# Altium schematic sheet Uav_V2.SchDoc: UAV Serial Switch
size A3; DrawnBy: Stefanie Schmidiger; Organization: HSLU T&A; Address1: Abteilung Elektrotechnik; Address2: Technikumsstrasse 21; Address3: CH-6048 Horw; Revision: 1; SheetNumber: 1; SheetTotal: 1; Projektname: UAV Serial Switch; PageSetup: Record=PageOptions|CenterHorizontal=True|CenterVertical=True|PrintScale=0.73|XCorrection=1.00|YCorrection=1.00|PrintKind=0|BorderSize=5000000|LeftOffset=0|BottomOffset=0|Orientation=2|PaperLength=1000|PaperWidth=1000|Scale=100|PaperSource=7|PrintQuality=-3|MediaType=1|DitherType=10|PrintScaleMode=1|PaperKind=A4|PaperIndex=9
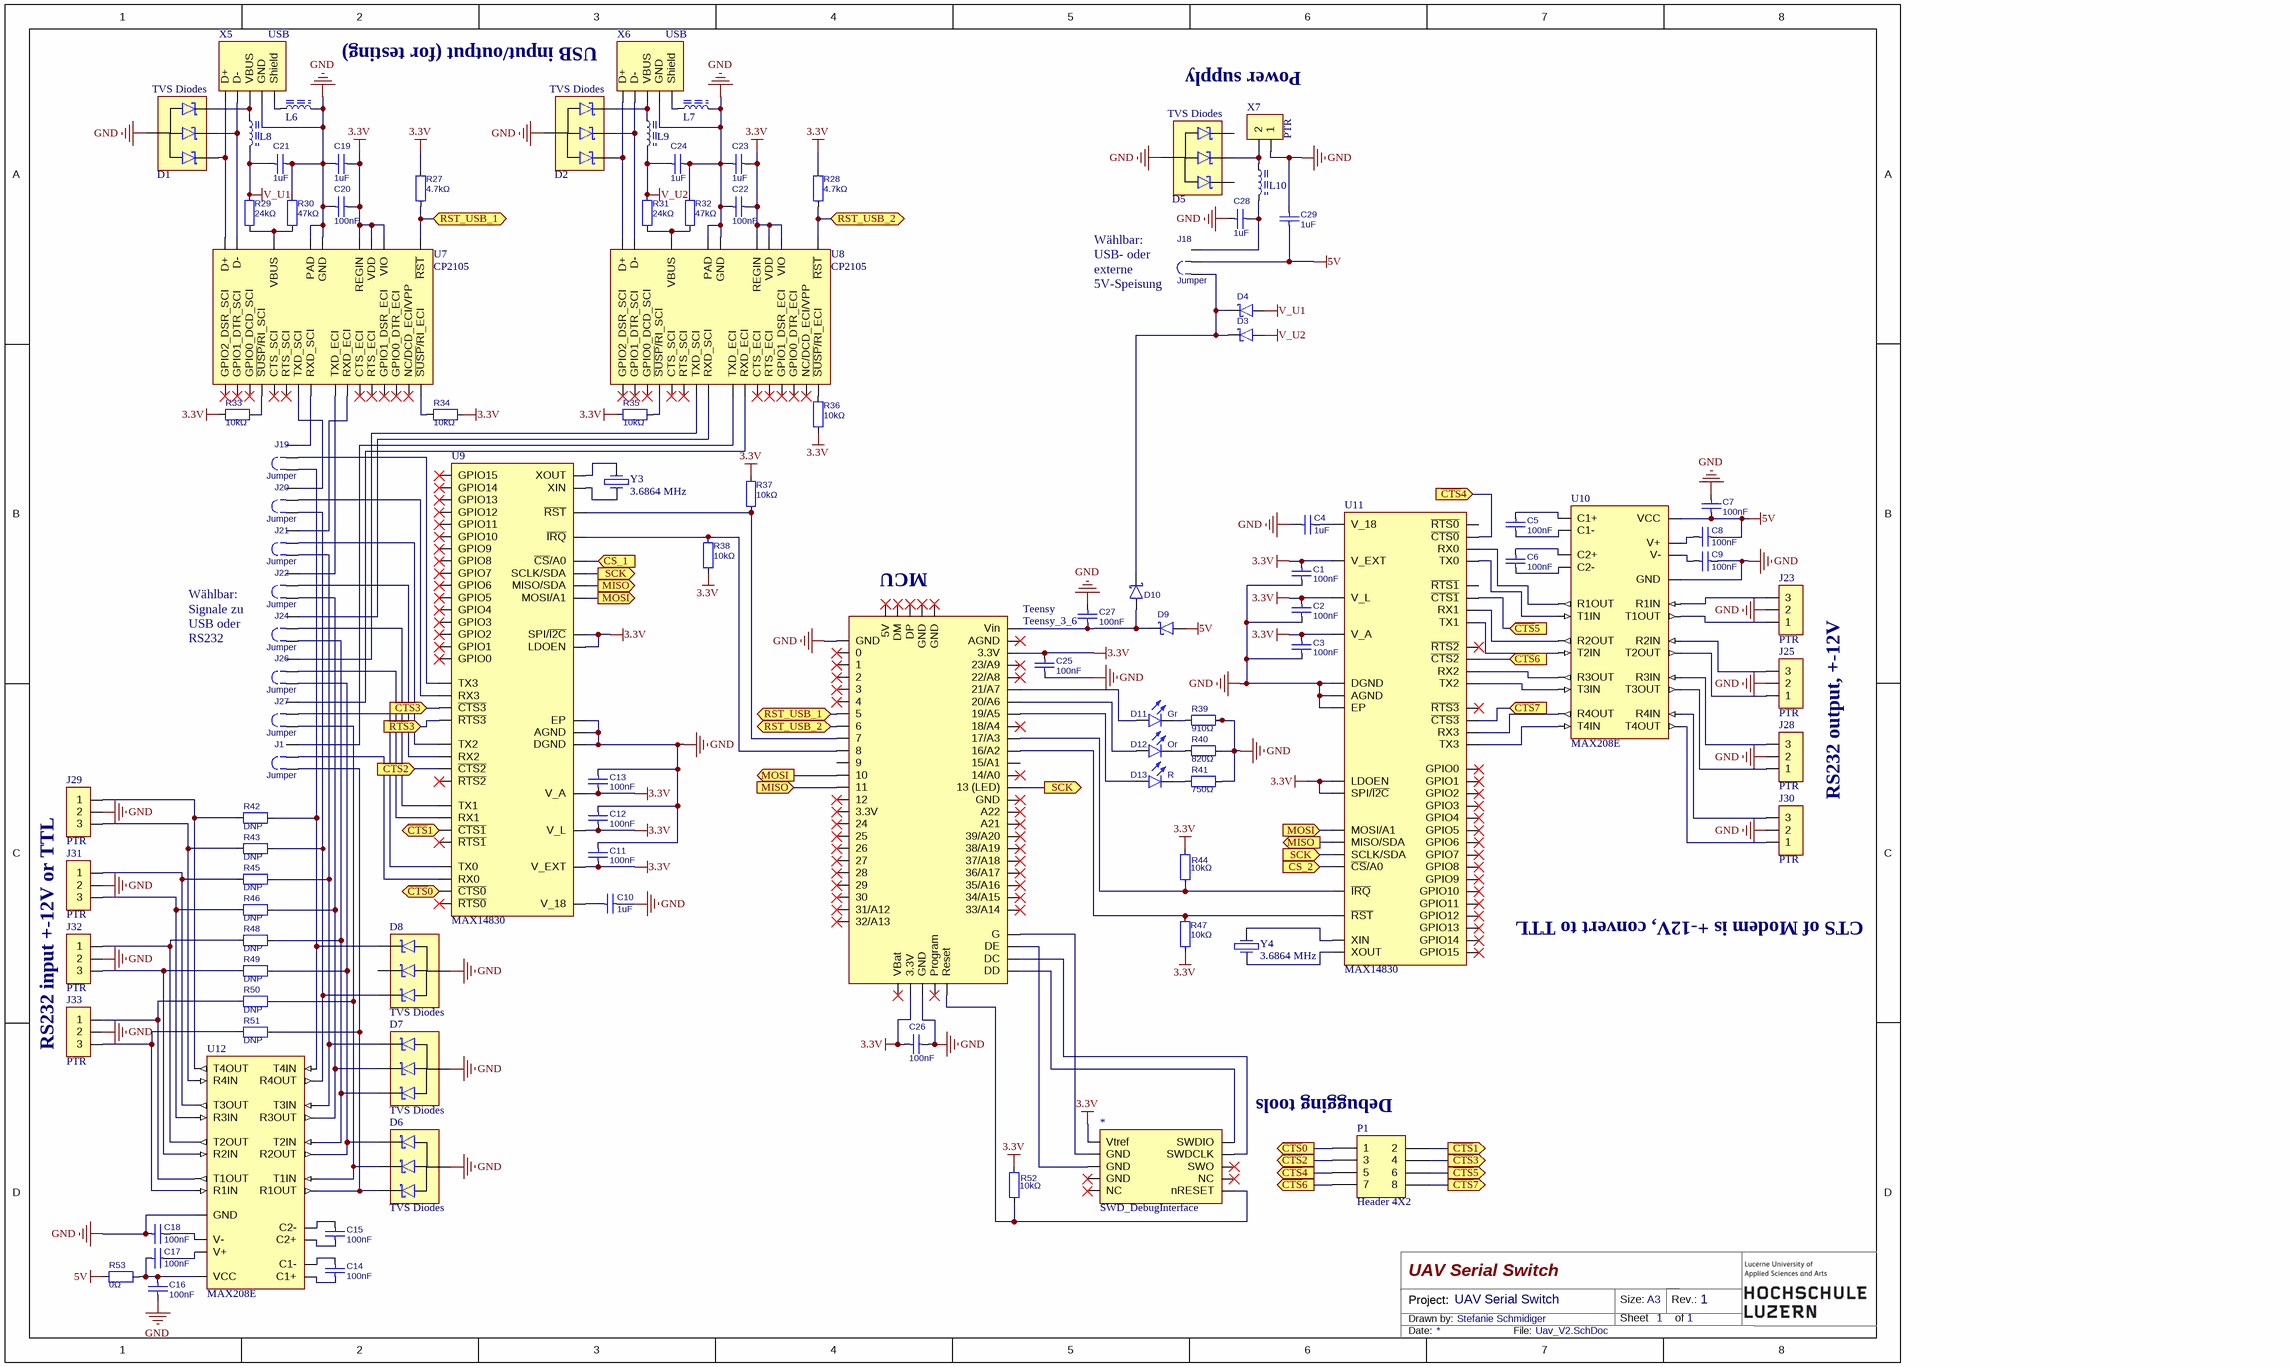
[diagram p0: Uav_V2.SchDoc]

## Parts
*  SWD_DebugInterface  [SWD Debug Interface]
C1  100nF  [0603]
C2  100nF  [0603]
C3  100nF  [0603]
C4  1uF  [0603]
C5  100nF  [0603]
C6  100nF  [0603]
C7  100nF  [0603]
C8  100nF  [0603]
C9  100nF  [0603]
C10  1uF  [0603]
C11  100nF  [0603]
C12  100nF  [0603]
C13  100nF  [0603]
C14  100nF  [0603]
C15  100nF  [0603]
C16  100nF  [0603]
C17  100nF  [0603]
C18  100nF  [0603]
C19  1uF  [0603]
C20  100nF  [0603]
C21  1uF  [0603]
C22  100nF  [0603]
C23  1uF  [0603]
C24  1uF  [0603]
C25  100nF  [0603]
C26  100nF  [0603]
C27  100nF  [0603]
C28  1uF  [0603]
C29  1uF  [0603]
D1  TVS Diodes  [SOT-143-4]
D2  TVS Diodes  [SOT-143-4]
D3  ?  [SOD_123]  (value not drawn)
D4  ?  [SOD_123]  (value not drawn)
D5  TVS Diodes  [SOT-143-4]
D6  TVS Diodes  [SOT-143-4]
D7  TVS Diodes  [SOT-143-4]
D8  TVS Diodes  [SOT-143-4]
D9  ?  [SOD_123]  (value not drawn)
D10  ?  [SOD_123]  (value not drawn)
D11  Gr  [0603D]
D12  Or  [0603D]
D13  R  [0603D]
J1  Jumper  [HDR1X3]
J18  Jumper  [HDR1X3]
J19  Jumper  [HDR1X3]
J20  Jumper  [HDR1X3]
J21  Jumper  [HDR1X3]
J22  Jumper  [HDR1X3]
J23  PTR  [PTR_1X3]
J24  Jumper  [HDR1X3]
J25  PTR  [PTR_1X3]
J26  Jumper  [HDR1X3]
J27  Jumper  [HDR1X3]
J28  PTR  [PTR_1X3]
J29  PTR  [PTR_1X3]
J30  PTR  [PTR_1X3]
J31  PTR  [PTR_1X3]
J32  PTR  [PTR_1X3]
J33  PTR  [PTR_1X3]
L6  MPZ1608S601A  [0603]  (value not drawn)
L7  MPZ1608S601A  [0603]  (value not drawn)
L8  MPZ1608S601A  [0603]  (value not drawn)
L9  MPZ1608S601A  [0603]  (value not drawn)
L10  MPZ1608S601A  [0603]  (value not drawn)
P1  Header 4X2  [HDR2X4]
R27  4.7kΩ  [0603]
R28  4.7kΩ  [0603]
R29  24kΩ  [0603]
R30  47kΩ  [0603]
R31  24kΩ  [0603]
R32  47kΩ  [0603]
R33  10kΩ  [0603]
R34  10kΩ  [0603]
R35  10kΩ  [0603]
R36  10kΩ  [0603]
R37  10kΩ  [0603]
R38  10kΩ  [0603]
R39  910Ω  [0603]
R40  820Ω  [0603]
R41  750Ω  [0603]
R42  DNP  [0603]
R43  DNP  [0603]
R44  10kΩ  [0603]
R45  DNP  [0603]
R46  DNP  [0603]
R47  10kΩ  [0603]
R48  DNP  [0603]
R49  DNP  [0603]
R50  DNP  [0603]
R51  DNP  [0603]
R52  10kΩ  [0603]
R53  0Ω  [0603]
Teensy  Teensy_3_6
U7  CP2105  [QFN24]
U8  CP2105  [QFN24]
U9  MAX14830  [TQFN48]
U10  MAX208E  [SSOP24]
U11  MAX14830  [TQFN48]
U12  MAX208E  [SSOP24]
X5  USB  [ZX63-B-5PA(30)]
X6  USB  [ZX63-B-5PA(30)]
X7  PTR  [PTR_1X2]
Y3  3.6864 MHz  [Crystal_10x4_5mm]
Y4  3.6864 MHz  [Crystal_10x4_5mm]

## Ports
CS_1 (in), CS_2 (in), MISO (in), MISO (out), MOSI (in), MOSI (out), RST_USB_1, RST_USB_2, SCK (in), SCK (out), ~{CTS}0 (in), ~{CTS}0 (out), ~{CTS}1 (in), ~{CTS}1 (out), ~{CTS}2 (in), ~{CTS}2 (out), ~{CTS}3 (in), ~{CTS}3 (out), ~{CTS}4 (in), ~{CTS}4 (out), ~{CTS}5 (in), ~{CTS}5 (out), ~{CTS}6 (in), ~{CTS}6 (out), ~{CTS}7 (in), ~{CTS}7 (out), ~{RTS}3 (in)

## Nets
3.3V: *.1(Vtref) C1.2 C2.2 C3.2 C11.2 C12.2 C13.2 C19.1 C20.1 C22.1 C23.1 C25.1 C26.1 R27.2 R28.2 R33.2 R34.1 R35.2 R36.1 R37.2 R38.1 R44.2 R47.1 R52.2 Teensy.3.3V_1(3.3V) Teensy.3.3V_2(3.3V) U7.5(VIO) U7.6(VDD) U7.7(REGIN) U8.5(VIO) U8.6(VDD) U8.7(REGIN) U9.1(SPI/~{I2C}) U9.2(LDOEN) U9.9(V_L) U9.43(V_EXT) U9.47(V_A) U11.1(SPI/~{I2C}) U11.2(LDOEN) U11.9(V_L) U11.43(V_EXT) U11.47(V_A)
5V: C7.1 C8.1 C29.1 D9.1(A) J18.2 R53.2 U10.9(VCC)
GND: C1.1 C2.1 C3.1 C4.1 C7.2 C9.1 C10.1 C11.1 C12.1 C13.1 C16.2 C18.1 C19.2 C20.2 C21.1 C22.2 C23.2 C24.1 C25.2 C26.2 C27.1 C28.2 C29.2 D1.1(CA) D2.1(CA) D5.1(CA) D6.1(CA) D7.1(CA) D8.1(CA) J23.2 J25.2 J28.2 J29.2 J30.2 J31.2 J32.2 J33.2 L6.2 L7.2 R30.1 R32.1 R39.1 R40.1 R41.1 Teensy.GND_1(GND) Teensy.GND_2(GND) U7.2(GND) U7.25(PAD) U8.2(GND) U8.25(PAD) U9.10(DGND) U9.46(AGND) U9.49(EP) U10.8(GND) U11.10(DGND) U11.46(AGND) U11.49(EP) U12.8(GND) X5.4(GND) X6.4(GND) X7.1
V_U1: C21.2 D4.1(A) L8.2 R29.1
V_U2: C24.2 D3.1(A) L9.2 R31.1
~{CTS}0: P1.1 U9.16(~{CTS0}) ; port ~{CTS}0
~{CTS}1: P1.2 U9.24(~{CTS1}) ; port ~{CTS}1
~{CTS}2: P1.3 U9.32(~{CTS2}) ; port ~{CTS}2
~{CTS}3: P1.4 U9.40(~{CTS3}) ; port ~{CTS}3
~{CTS}4: P1.5 U11.16(~{CTS0}) ; port ~{CTS}4
~{CTS}5: P1.6 U11.24(~{CTS1}) ; port ~{CTS}5
~{CTS}6: P1.7 U11.32(~{CTS2}) ; port ~{CTS}6
~{CTS}7: P1.8 U11.40(~{CTS3}) ; port ~{CTS}7
~{RTS}3: U9.39(~{RTS3}) ; port ~{RTS}3
CS_1: U9.5(~{CS}/A0) ; port CS_1
CS_2: U11.5(~{CS}/A0) ; port CS_2
MISO: Teensy.11 U9.3(MISO/SDA) U11.3(MISO/SDA) ; port MISO
MOSI: Teensy.10 U9.6(MOSI/A1) U11.6(MOSI/A1) ; port MOSI
RST_USB_1: R27.1 Teensy.5 U7.9(~{RST}) ; port RST_USB_1
RST_USB_2: R28.1 Teensy.6 U8.9(~{RST}) ; port RST_USB_2
SCK: Teensy.13(13_(LED)) U9.4(SCLK/SDA) U11.4(SCLK/SDA) ; port SCK
Net*_2: *.2(SWDIO) Teensy.DD
Net*_4: *.4(SWDCLK) Teensy.DC
Net*_7: *.7(GND) Teensy.DE
Net*_9: *.9(GND) Teensy.GND_4(G)
Net*_10: *.10(nRESET) R52.1 Teensy.Reset
NetC4_2: C4.2 U11.48(V_18)
NetC5_1: C5.1 U10.12(C1-)
NetC5_2: C5.2 U10.10(C1+)
NetC6_1: C6.1 U10.14(C2-)
NetC6_2: C6.2 U10.13(C2+)
NetC8_2: C8.2 U10.11(V+)
NetC9_2: C9.2 U10.15(V-)
NetC10_2: C10.2 U9.48(V_18)
NetC14_1: C14.1 U12.12(C1-)
NetC14_2: C14.2 U12.10(C1+)
NetC15_1: C15.1 U12.14(C2-)
NetC15_2: C15.2 U12.13(C2+)
NetC16_1: C16.1 C17.1 R53.1 U12.9(VCC)
NetC17_2: C17.2 U12.11(V+)
NetC18_2: C18.2 U12.15(V-)
NetC27_2: C27.2 D9.2(K) D10.1(A) Teensy.Vin
NetC28_1: C28.1 J18.3 L10.2
NetD1_2: D1.2(K1) U7.3(D+) X5.3(D+)
NetD1_3: D1.3(K2) U7.4(D-) X5.2(D-)
NetD1_4: D1.4(K3) L8.1 X5.1(VBUS)
NetD2_2: D2.2(K1) U8.3(D+) X6.3(D+)
NetD2_3: D2.3(K2) U8.4(D-) X6.2(D-)
NetD2_4: D2.4(K3) L9.1 X6.1(VBUS)
NetD3_2: D3.2(K) D4.2(K) D10.2(K) J18.1
NetD5_3: D5.3(K2) L10.1 X7.2
NetD6_2: D6.2(K1) J26.1 R49.1 U12.4(R2OUT)
NetD6_3: D6.3(K2) J27.1 R50.1 U12.5(T1IN)
NetD6_4: D6.4(K3) J1.1 R51.1 U12.6(R1OUT)
NetD7_2: D7.2(K1) J21.1 R45.1 U12.19(T3IN)
NetD7_3: D7.3(K2) J22.1 R46.1 U12.22(R3OUT)
NetD7_4: D7.4(K3) J24.1 R48.1 U12.18(T2IN)
NetD8_2: D8.2(K1) J19.1 R42.1 U12.21(T4IN)
NetD8_4: D8.4(K3) J20.1 R43.1 U12.17(R4OUT)
NetD11_1: D11.1(A) Teensy.21(21/A7)
NetD11_2: D11.2(K) R39.2
NetD12_1: D12.1(A) Teensy.20(20/A6)
NetD12_2: D12.2(K) R40.2
NetD13_1: D13.1(A) Teensy.19(19/A5)
NetD13_2: D13.2(K) R41.2
NetJ1_2: J1.2 U9.17(RX0)
NetJ1_3: J1.3 U8.13(TXD_ECI)
NetJ19_2: J19.2 U9.42(TX3)
NetJ19_3: J19.3 U7.20(RXD_SCI)
NetJ20_2: J20.2 U9.41(RX3)
NetJ20_3: J20.3 U7.21(TXD_SCI)
NetJ21_2: J21.2 U9.34(TX2)
NetJ21_3: J21.3 U7.12(RXD_ECI)
NetJ22_2: J22.2 U9.33(RX2)
NetJ22_3: J22.3 U7.13(TXD_ECI)
NetJ23_1: J23.1 U10.2(T1OUT)
NetJ23_3: J23.3 U10.7(R1IN)
NetJ24_2: J24.2 U9.26(TX1)
NetJ24_3: J24.3 U8.20(RXD_SCI)
NetJ25_1: J25.1 U10.1(T2OUT)
NetJ25_3: J25.3 U10.3(R2IN)
NetJ26_2: J26.2 U9.25(RX1)
NetJ26_3: J26.3 U8.21(TXD_SCI)
NetJ27_2: J27.2 U9.18(TX0)
NetJ27_3: J27.3 U8.12(RXD_ECI)
NetJ28_1: J28.1 U10.24(T3OUT)
NetJ28_3: J28.3 U10.23(R3IN)
NetJ29_1: J29.1 R42.2 U12.20(T4OUT)
NetJ29_3: J29.3 R43.2 U12.16(R4IN)
NetJ30_1: J30.1 U10.20(T4OUT)
NetJ30_3: J30.3 U10.16(R4IN)
NetJ31_1: J31.1 R45.2 U12.24(T3OUT)
NetJ31_3: J31.3 R46.2 U12.23(R3IN)
NetJ32_1: J32.1 R48.2 U12.1(T2OUT)
NetJ32_3: J32.3 R49.2 U12.3(R2IN)
NetJ33_1: J33.1 R50.2 U12.2(T1OUT)
NetJ33_3: J33.3 R51.2 U12.7(R1IN)
NetL6_1: L6.1 X5.0(Shield)
NetL7_1: L7.1 X6.0(Shield)
NetR29_2: R29.2 R30.2 U7.8(VBUS)
NetR31_2: R31.2 R32.2 U8.8(VBUS)
NetR33_1: R33.1 U7.1(~{SUSP}/RI_SCI)
NetR34_2: R34.2 U7.17(~{SUSP}/RI_ECI)
NetR35_1: R35.1 U8.1(~{SUSP}/RI_SCI)
NetR36_2: R36.2 U8.17(~{SUSP}/RI_ECI)
NetR37_1: R37.1 Teensy.7 U9.8(~{RST})
NetR38_2: R38.2 Teensy.8 U9.7(~{IRQ})
NetR44_1: R44.1 Teensy.17(17/A3) U11.7(~{IRQ})
NetR47_2: R47.2 Teensy.16(16/A2) U11.8(~{RST})
NetU9_44: U9.44(XOUT) Y3.2
NetU9_45: U9.45(XIN) Y3.1
NetU10_4: U10.4(R2OUT) U11.25(RX1)
NetU10_5: U10.5(T1IN) U11.18(TX0)
NetU10_6: U10.6(R1OUT) U11.17(RX0)
NetU10_17: U10.17(R4OUT) U11.41(RX3)
NetU10_18: U10.18(T2IN) U11.26(TX1)
NetU10_19: U10.19(T3IN) U11.34(TX2)
NetU10_21: U10.21(T4IN) U11.42(TX3)
NetU10_22: U10.22(R3OUT) U11.33(RX2)
NetU11_44: U11.44(XOUT) Y4.1
NetU11_45: U11.45(XIN) Y4.2

Not connected (* = marked no-connect by the designer): * 3(NC)* 5(GND)* 6(SWO)* 8(NC)*; D5 2(K1) 4(K3); D8 3(K2); Teensy 0* 1* 2* 3* 3.3V* 4* 5V_USB(5V)* 9 12* 14(14/A0)* 15(15/A1) 18(18/A4)* 22(22/A8)* 23(23/A9)* 24* 25* 26* 27* 28* 29* 30* 31(31/A12)* 32(32/A13)* 33(33/A14)* 34(34/A15)* 35(35/A16)* 36(36/A17)* 37(37/A18)* 38(38/A19)* 39(39/A20)* A21* A22* AGND* DM* DP* GND_3(GND)* GND_5(GND)* GND_6(GND)* Program* VBat*; U7 10(CTS_ECI)* 11(RTS_ECI)* 14(GPIO1_DSR_ECI)* 15(GPIO0_DTR_ECI)* 16(NC/DCD_ECI/VPP)* 18(CTS_SCI)* 19(RTS_SCI)* 22(GPIO2_DSR_SCI)* 23(GPIO1_DTR_SCI)* 24(GPIO0_DCD_SCI)*; U8 10(CTS_ECI)* 11(RTS_ECI)* 14(GPIO1_DSR_ECI)* 15(GPIO0_DTR_ECI)* 16(NC/DCD_ECI/VPP)* 18(CTS_SCI)* 19(RTS_SCI)* 22(GPIO2_DSR_SCI)* 23(GPIO1_DTR_SCI)* 24(GPIO0_DCD_SCI)*; U9 11(GPIO0)* 12(GPIO1)* 13(GPIO2)* 14(GPIO3)* 15(~{RTS0})* 19(GPIO4)* 20(GPIO5)* 21(GPIO6)* 22(GPIO7)* 23(~{RTS1})* 27(GPIO8)* 28(GPIO9)* 29(GPIO10)* 30(GPIO11)* 31(~{RTS2})* 35(GPIO12)* 36(GPIO13)* 37(GPIO14)* 38(GPIO15)*; U11 11(GPIO0)* 12(GPIO1)* 13(GPIO2)* 14(GPIO3)* 15(~{RTS0}) 19(GPIO4)* 20(GPIO5)* 21(GPIO6)* 22(GPIO7)* 23(~{RTS1}) 27(GPIO8)* 28(GPIO9)* 29(GPIO10)* 30(GPIO11)* 31(~{RTS2})* 35(GPIO12)* 36(GPIO13)* 37(GPIO14)* 38(GPIO15)* 39(~{RTS3})*

## Notes on the sheet
- USB input/output (for testing)
- Power supply
- (near J18) Wählbar: USB- oder externe 5V-Speisung
- (near Teensy) MCU
- Wählbar: Signale zu USB oder RS232
- RS232 output, +-12V
- (near U11) CTS of Modem is +-12V, convert to TTL
- RS232 input +-12V or TTL
- Debugging tools
- Project:
- Drawn by:
- Size:
- Sheet
- A3
- Rev.:
- of
- Date:
- File:

## Library data of the parts
* = SWD_DebugInterface: Manufacturor Order Number: T821110A1R100CEU; Distributor: Farnell; Distributor Order Number: 2215290
C1-C29 = 4: Keramikkondensator 0603; Changed by: taalbiss; Number of pads: 2; Part ID: 4; Category: Capacitors - Ceramic; Distributor: Mouser; Distributor Order Number: 0; ComponentLink1URL: http://www.mouser.ch/Passive-Components/Capacitors/Ceramic-Capacitors/MLCCs-Multilayer-Ceramic-Capacitors/Multilayer-Ceramic-Capacitors-MLCC-SMD-SMT/_/N-bkrdv?P=1yzmou6; ComponentLink1Description: Mouser 0603 Ceramic Capacitors; Price: 0; Changed at: 21.07.2015 17:44:32; SMD: True
D1 D2 D5-D8 = TVS_Diode_3fach: Distributor Order Number: 576-SP0503BAHTG; Distributor: Mouser
D3 D4 D9 D10 = 49: Schottky Diode SOD-123; Changed by: taalbiss; Number of pads: 2; Part ID: 49; Category: Diodes; Distributor: Mouser; Distributor Order Number: 863-MBR0520LT1G; ComponentLink1URL: http://www.mouser.ch/Semiconductors/Discrete-Semiconductors/Diodes-Rectifiers/Schottky-Diodes-Rectifiers/_/N-ax1mj?P=1z0yr4v; ComponentLink1Description: Mouser SOD-123 Schottky Diodes; Price: 0; Changed at: 04.08.2015 09:41:59; SMD: True
D11-D13 = 109: LED SMD 0603; Changed by: taalbiss; Number of pads: 2; Part ID: 109; Category: Optical; Distributor: Mouser; ComponentLink1URL: http://www.mouser.ch/Optoelectronics/LED-Lighting/LED-Emitters/Standard-LEDs-SMD/_/N-b1bb1?P=1yzvlv6Z1yzvlkx; ComponentLink1Description: Mouser 0603 LED's; Price: 0; Changed at: 28.08.2015 11:09:55; SMD: True
  D11: Distributor Order Number: 720-LGL29KG2J124Z
  D12: Distributor Order Number: 720-LOL29KH2L124Z
  D13: Distributor Order Number: 720-LSL296-N2Q1-1-Z
J1 J18-J22 J24 J26 J27 = 107: Jumper THT 2.54mm 1x3; Changed by: taalbiss; Number of pads: 3; Part ID: 107; Category: Connectors; Distributor: ?; Distributor Order Number: 0; Price: 0; Changed at: 26.08.2015 10:33:14; SMD: False
J23 J25 J28-J33 = Header_1x3: Distributor: Distrelec; Distributor Order Number: STLZ1550/03-3.81-H
L6-L10 = 45: Ferrit 0603; Changed by: taalbiss; Number of pads: 2; Part ID: 45; Category: Ferrites; Distributor: Mouser; Distributor Order Number: 810-MPZ1608S601A; ComponentLink1URL: http://www.mouser.ch/Passive-Components/EMI-RFI-Components/EMI-Filter-Beads-Chips-Arrays/_/N-bw7pa?P=1yzvlkx; ComponentLink1Description: Mouser 0603 Ferrites; Price: 0; Changed at: 03.08.2015 14:45:01; SMD: True
P1 = Header 4X2: Header, 4-Pin, Dual row; LatestRevisionDate: 17-Jul-2002; LatestRevisionNote: Re-released for DXP Platform.; Publisher: Altium Limited
R27-R53 = 2: Widerstand 0603; Changed by: taalbiss; Number of pads: 2; Part ID: 2; Category: Resistors; Distributor: Mouser; ComponentLink1URL: http://www.mouser.ch/Passive-Components/Resistors/SMD-Resistors-Chip-Resistors/_/N-7h7yu?P=1yzmou6; ComponentLink1Description: Mouser 0603 Resistors; Price: 0; Changed at: 21.07.2015 17:44:48; SMD: True
  R27 R28: Distributor Order Number: 660-RK73H1JTTD4701F
  R29 R31: Distributor Order Number: 71-CRCW0603-24K-E3
  R30 R32: Distributor Order Number: 755-KTR03EZPF4702
  R33-R38 R44 R47 R52: Distributor Order Number: 71-CRCW0603-10K-E3
  R39-R43 R45 R46 R48-R51 R53: Distributor Order Number: 0
X7 = Header_1x2: Distributor Order Number: 148-41-250; Distributor: Distrelec
Y3 Y4 = Crystal_3_6864_MHz: Distributor Order Number: 559-FQ1045AR-3.6864; Distributor: Mouser
U7 U8 = CP2105: Distributor Order Number: 634-CP2105-F01-GM; Distributor: Mouser
U9 U11 = MAX14830: Distributor Order Number: 700-MAX14830ETM+; Distributor: Mouser
U10 U12 = MAX208E: Distributor Order Number: 700-MAX208ECAG; Distributor: Mouser
X5 X6 = USB: Distributor Order Number: ZX62-B-5PA(30); Distributor: Mouser